# EAGLE design 2164_svf_breakout_planes (EAGLE 9.6.2)
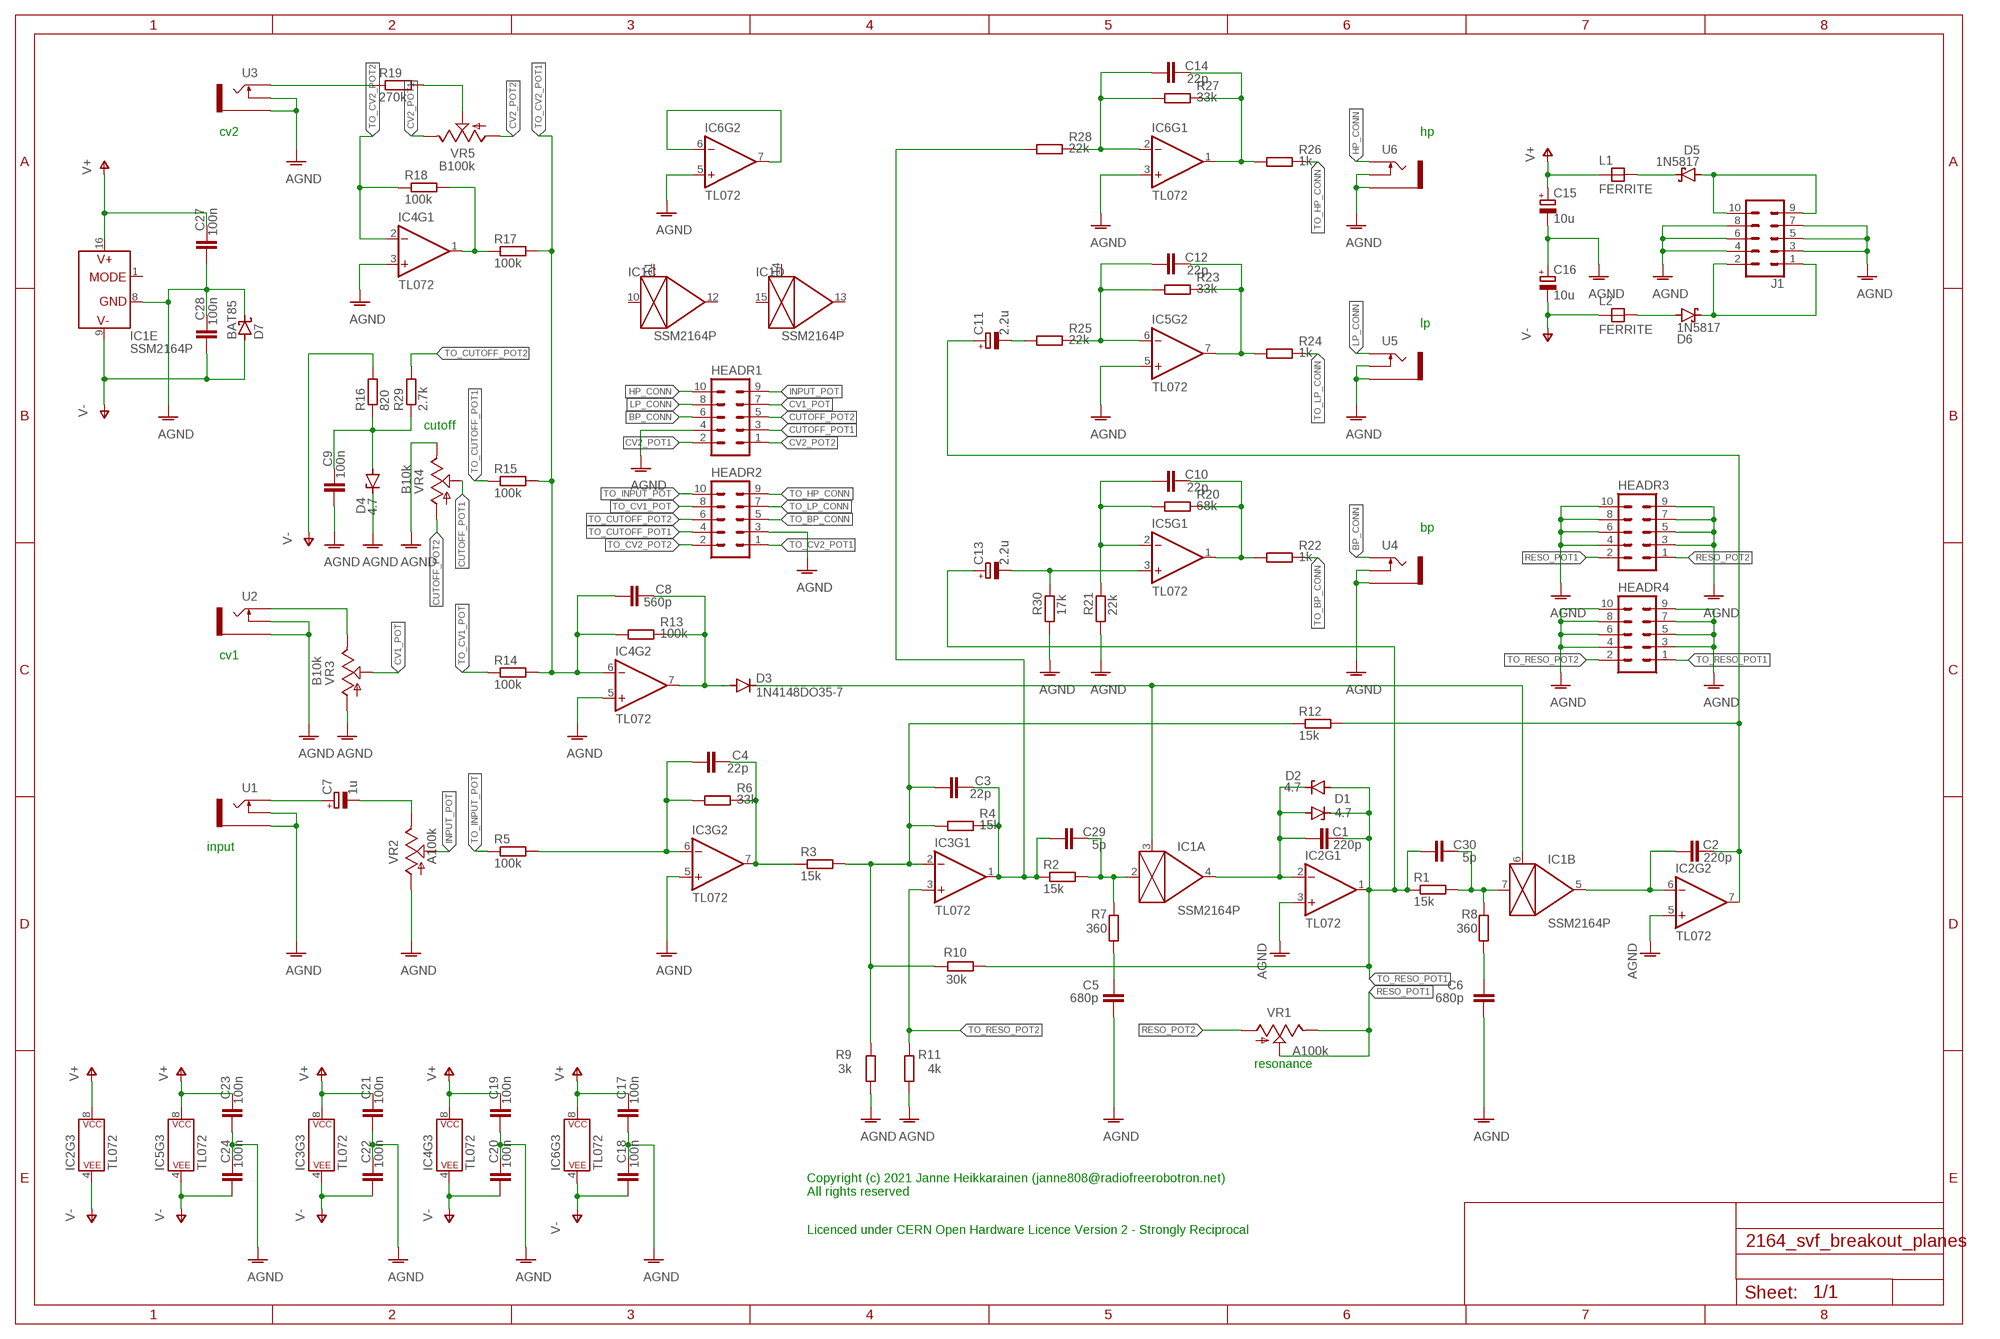
[diagram p0: schematic, sheet 1]

## Parts
C1  220p  C-EU050-025X075  [C050-025X075]
C2  220p  C-EU050-025X075  [C050-025X075]
C3  22p  C-EU050-025X075  [C050-025X075]
C4  22p  C-EU050-025X075  [C050-025X075]
C5  680p  C-EU050-025X075  [C050-025X075]
C6  680p  C-EU050-025X075  [C050-025X075]
C7  1u  CPOL-EUE2,5-6E  [E2,5-6E]
C8  560p  C-EU050-025X075  [C050-025X075]
C9  100n  C-EU050-025X075  [C050-025X075]
C10  22p  C-EU050-025X075  [C050-025X075]
C11  2.2u  CPOL-EUE2,5-6E  [E2,5-6E]
C12  22p  C-EU050-025X075  [C050-025X075]
C13  2.2u  CPOL-EUE2,5-6E  [E2,5-6E]
C14  22p  C-EU050-025X075  [C050-025X075]
C15  10u  CPOL-EUE2,5-6E  [E2,5-6E]
C16  10u  CPOL-EUE2,5-6E  [E2,5-6E]
C17  100n  C-EU050-025X075  [C050-025X075]
C18  100n  C-EU050-025X075  [C050-025X075]
C19  100n  C-EU050-025X075  [C050-025X075]
C20  100n  C-EU050-025X075  [C050-025X075]
C21  100n  C-EU050-025X075  [C050-025X075]
C22  100n  C-EU050-025X075  [C050-025X075]
C23  100n  C-EU050-025X075  [C050-025X075]
C24  100n  C-EU050-025X075  [C050-025X075]
C27  100n  C-EU050-025X075  [C050-025X075]
C28  100n  C-EU050-025X075  [C050-025X075]
C29  5p  C-EU050-025X075  [C050-025X075]
C30  5p  C-EU050-025X075  [C050-025X075]
D1  4.7  ZENER-DIODEDO34-7  [DO34Z7]
D2  4.7  ZENER-DIODEDO34-7  [DO34Z7]
D3  1N4148DO35-7  [DO35-7]
D4  4.7  ZENER-DIODEDO34-7  [DO34Z7]
D5  1N5817  SCHOTTKY-DIODEDO35-7  [DO35-7]
D6  1N5817  SCHOTTKY-DIODEDO35-7  [DO35-7]
D7  BAT85  SCHOTTKY-DIODEDO35-7  [DO35-7]
HEADR1  10PIN_BACKSIDE  [10PIN_BACKSIDE]
HEADR2  10PIN_BACKSIDE  [10PIN_BACKSIDE]
HEADR3  10PIN_BACKSIDE  [10PIN_BACKSIDE]
HEADR4  10PIN_BACKSIDE  [10PIN_BACKSIDE]
IC1  SSM2164P  [DIL16]
IC2  TL072  OPAMP-DUALDIP  [DIP08]
IC3  TL072  OPAMP-DUALDIP  [DIP08]
IC4  TL072  OPAMP-DUALDIP  [DIP08]
IC5  TL072  OPAMP-DUALDIP  [DIP08]
IC6  TL072  OPAMP-DUALDIP  [DIP08]
J1  CONN_05X2SHD  [2X5-SHROUDED]
L1  FERRITE  FB-085  [FB-085]
L2  FERRITE  FB-085  [FB-085]
R1  15k  R-EU_0207/2V  [0207/2V]
R2  15k  R-EU_0207/2V  [0207/2V]
R3  15k  R-EU_0207/2V  [0207/2V]
R4  15k  R-EU_0207/2V  [0207/2V]
R5  100k  R-EU_0207/2V  [0207/2V]
R6  33k  R-EU_0207/2V  [0207/2V]
R7  360  R-EU_0207/2V  [0207/2V]
R8  360  R-EU_0207/2V  [0207/2V]
R9  3k  R-EU_0207/2V  [0207/2V]
R10  30k  R-EU_0207/2V  [0207/2V]
R11  4k  R-EU_0207/2V  [0207/2V]
R12  15k  R-EU_0207/2V  [0207/2V]
R13  100k  R-EU_0207/2V  [0207/2V]
R14  100k  R-EU_0207/2V  [0207/2V]
R15  100k  R-EU_0207/2V  [0207/2V]
R16  820  R-EU_0207/2V  [0207/2V]
R17  100k  R-EU_0207/2V  [0207/2V]
R18  100k  R-EU_0207/2V  [0207/2V]
R19  270k  R-EU_0207/2V  [0207/2V]
R20  68k  R-EU_0207/2V  [0207/2V]
R21  22k  R-EU_0207/2V  [0207/2V]
R22  1k  R-EU_0207/2V  [0207/2V]
R23  33k  R-EU_0207/2V  [0207/2V]
R24  1k  R-EU_0207/2V  [0207/2V]
R25  22k  R-EU_0207/2V  [0207/2V]
R26  1k  R-EU_0207/2V  [0207/2V]
R27  33k  R-EU_0207/2V  [0207/2V]
R28  22k  R-EU_0207/2V  [0207/2V]
R29  2.7k  R-EU_0207/2V  [0207/2V]
R30  17k  R-EU_0207/2V  [0207/2V]
U1  THONKICONNNEW  [WQP-PJ301M-12_JACK]
U2  THONKICONNNEW  [WQP-PJ301M-12_JACK]
U3  THONKICONNNEW  [WQP-PJ301M-12_JACK]
U4  THONKICONNNEW  [WQP-PJ301M-12_JACK]
U5  THONKICONNNEW  [WQP-PJ301M-12_JACK]
U6  THONKICONNNEW  [WQP-PJ301M-12_JACK]
VR1  A100k  9MM_SNAP-IN_POT_  [9MM_SNAP-IN_POT]
VR2  A100k  9MM_SNAP-IN_POT_  [9MM_SNAP-IN_POT]
VR3  B10k  9MM_SNAP-IN_POT_  [9MM_SNAP-IN_POT]
VR4  B10k  9MM_SNAP-IN_POT_  [9MM_SNAP-IN_POT]
VR5  B100k  9MM_SNAP-IN_POT_  [9MM_SNAP-IN_POT]

## Nets
AGND: C5.1 C6.1 C9.1 C15.- C16.+ C17.1 C18.2 C19.1 C20.2 C21.1 C22.2 C23.1 C24.2 C27.1 C28.2 D4.C D7.C HEADR1.4 HEADR2.3 HEADR3.3 HEADR3.4 HEADR3.5 HEADR3.6 HEADR3.7 HEADR3.8 HEADR3.9 HEADR3.10 HEADR4.3 HEADR4.4 HEADR4.5 HEADR4.6 HEADR4.7 HEADR4.8 HEADR4.9 HEADR4.10 IC1.8(E:GND) IC2.3(+IN) IC2.5(+IN) IC3.5(+IN) IC4.3(+IN) IC4.5(+IN) IC5.5(+IN) IC6.3(+IN) IC6.5(+IN) J1.3 J1.4 J1.5 J1.6 J1.7 J1.8 R9.1 R11.1 R21.1 R30.1 U1.P$2_SWITCH(SWITCH) U1.P$3_SLEEVE(SLEEVE) U2.P$2_SWITCH(SWITCH) U2.P$3_SLEEVE(SLEEVE) U3.P$2_SWITCH(SWITCH) U3.P$3_SLEEVE(SLEEVE) U4.P$2_SWITCH(SWITCH) U4.P$3_SLEEVE(SLEEVE) U5.P$2_SWITCH(SWITCH) U5.P$3_SLEEVE(SLEEVE) U6.P$2_SWITCH(SWITCH) U6.P$3_SLEEVE(SLEEVE) VR2.1(A) VR3.1(A) VR4.3(E)
BP_CONN: HEADR1.6 U4.P$1_TIP(TIP)
CUTOFF_POT1: HEADR1.3 VR4.2(S)
CUTOFF_POT2: HEADR1.5 VR4.1(A)
CV1_POT: HEADR1.7 VR3.2(S)
CV2_POT1: HEADR1.2 VR5.3(E)
CV2_POT2: HEADR1.1 VR5.1(A)
HP_CONN: HEADR1.10 U6.P$1_TIP(TIP)
INPUT_POT: HEADR1.9 VR2.2(S)
LP_CONN: HEADR1.8 U5.P$1_TIP(TIP)
N$1: C1.1 D1.A D2.C IC1.4(A:OUT) IC2.2(-IN)
N$2: C2.1 IC1.5(B:OUT) IC2.6(-IN)
N$3: C13.- IC5.3(+IN) R30.2
N$4: C30.2 IC1.7(B:IN) R1.2 R8.2
N$5: C3.2 C29.1 IC3.1(OUT) R2.1 R4.2 R28.1
N$6: C29.2 IC1.2(A:IN) R2.2 R7.2
N$7: C9.2 D4.A R16.1 R29.1
N$8: C4.2 IC3.7(OUT) R3.1 R6.2
N$9: C3.1 IC3.2(-IN) R3.2 R4.1 R9.2 R10.2 R12.1
N$10: C4.1 IC3.6(-IN) R5.2 R6.1
N$12: C2.2 C11.+ IC2.7(OUT) R12.2
N$13: C7.- VR2.3(E)
N$14: C7.+ U1.P$1_TIP(TIP)
N$15: C5.2 R7.1
N$16: C6.2 R8.1
N$17: C8.2 D3.A IC4.7(OUT) R13.2
N$18: D3.C IC1.3(A:CTRL) IC1.6(B:CTRL)
N$21: U2.P$1_TIP(TIP) VR3.3(E)
N$23: IC4.1(OUT) R17.1 R18.2
N$26: C10.1 IC5.2(-IN) R20.1 R21.2
N$27: R19.1 U3.P$1_TIP(TIP)
N$28: R19.2 VR5.2(S)
N$29: C10.2 IC5.1(OUT) R20.2 R22.1
N$31: C12.1 IC5.6(-IN) R23.1 R25.2
N$33: C12.2 IC5.7(OUT) R23.2 R24.1
N$34: C11.- R25.1
N$37: IC6.6(-IN) IC6.7(OUT)
N$38: D5.C L1.2
N$39: C14.2 IC6.1(OUT) R26.1 R27.2
N$40: C14.1 IC6.2(-IN) R27.1 R28.2
N$41: D6.A L2.2
N$42: D6.C J1.1 J1.2
N$43: D5.A J1.9 J1.10
RESO_POT1: HEADR3.2 VR1.2(S) VR1.3(E)
RESO_POT2: HEADR3.1 VR1.1(A)
TO_BP_CONN: HEADR2.5 R22.2
TO_CUTOFF_POT1: HEADR2.4 R15.1
TO_CUTOFF_POT2: HEADR2.6 R29.2
TO_CV1_POT: HEADR2.8 R14.1
TO_CV2_POT1: C8.1 HEADR2.1 IC4.6(-IN) R13.1 R14.2 R15.2 R17.2
TO_CV2_POT2: HEADR2.2 IC4.2(-IN) R18.1
TO_HP_CONN: HEADR2.9 R26.2
TO_INPUT_POT: HEADR2.10 R5.1
TO_LP_CONN: HEADR2.7 R24.2
TO_RESO_POT1: C1.2 C13.+ C30.1 D1.C D2.A HEADR4.1 IC2.1(OUT) R1.1 R10.1
TO_RESO_POT2: HEADR4.2 IC3.3(+IN) R11.2
V+: C15.+ C17.2 C19.2 C21.2 C23.2 C27.2 IC1.16(E:V+) IC2.8(P$V+) IC3.8(P$V+) IC4.8(P$V+) IC5.8(P$V+) IC6.8(P$V+) L1.1
V-: C16.- C18.1 C20.1 C22.1 C24.1 C28.1 D7.A IC1.9(E:V-) IC2.4(P$V-) IC3.4(P$V-) IC4.4(P$V-) IC5.4(P$V-) IC6.4(P$V-) L2.1 R16.2
Unconnected: IC1.1(E:MODE) IC1.10(C:IN) IC1.11(C:CTRL) IC1.12(C:OUT) IC1.13(D:OUT) IC1.14(D:CTRL) IC1.15(D:IN)

## Notes on the sheet
- cv2 | hp
- lp
- cutoff
- bp
- cv1
- input
- resonance
- Copyright (c) 2021 Janne Heikkarainen (janne808@radiofreerobotron.net)
  All rights reserved
- Licenced under CERN Open Hardware Licence Version 2 - Strongly Reciprocal

## Library data of the parts
C1-C6 C8-C10 C12 C14 C17-C24 C27-C30 = rcl:C-EU: CAPACITOR, European symbol; SPICEPREFIX: C
C7 C11 C13 C15 C16 = rcl:CPOL-EU: POLARIZED CAPACITOR, European symbol; SPICEPREFIX: C
D1 D2 D4 = diode:ZENER-DIODE: Z-Diode
D3 = diode:1N4148: DIODE high speed (Philips)
D5-D7 = diode:SCHOTTKY-DIODE: Schottky Diode
HEADR1-HEADR4 = MusicThingModular:10PIN_BACKSIDE: PIN HEADER; OC_FARNELL: unknown; OC_NEWARK: unknown
IC1 = ssm2164:SSM2164
IC2-IC6 = SparkFun-IC-Amplifiers:OPAMP-DUAL: Generic op-amp footprint This component is for the standard 358 pinning of a dual op-amp From the LM358 datasheet: Pin 1: Output A Pin 2: Inverting Input A Pin 3: Non-Inverting Input A Pin 4: Gnd Pin 5: Non-Inverting Input B Pin 6: Inverting Input B Pin 7: Output B Pin 8: V+; PROD_ID: NA-XXXXX; VALUE: OP-AMP
J1 = SparkFun-Connectors:CONN_05X2: Multi connection point. Often used as Generic Header-pin footprint for 0.1 inch spaced/style header connections For AVR SPI programming port, see special device with nice symbol: "AVR_SPI_PROG_5x2.dev" You can populate with any combo of single row headers, but if you'd like an exact match, check these: 2x5 AVR ICSP Male Header <https://www.sparkfun.com/products/778> (PRT-00778) 2x5 Pin Shrouded Header <https://www.sparkfun.com/products/8506> (PRT-08506) On any of the 0.1 inch spaced packages, you can populate with these: Break Away Headers - Straight <https://www.sparkfun.com/products/116> (PRT-00116) Break Away Male Headers - Right Angle <https://www.sparkfun.com/products/553> (PRT-00553) Female Headers <https://www.sparkfun.com/products/115> (PRT-00115) Break Away Headers - Machine Pin <https://www.sparkfun.com/products/117> (PRT-00117) Break Away Female Headers - Swiss Machine Pin <https://www.sparkfun.com/products/743> (PRT-00743) Special note: the shrouded connector mates well with our 5x2 ribbon cables: 2x5 Pin IDC Ribbon Cable <https://www.sparkfun.com/products/8535> (PRT-08535); PROD_ID: CONN-08671; SF_ID: PRT-08506
L1 L2 = inductors-jwmiller:FB: FERRITE BEAD
R1-R30 = rcl:R-EU_: RESISTOR, European symbol; SPICEPREFIX: R
U1-U6 = MusicThingModular:THONKICONN: 3.5mm socket for Eurorack modular synths
VR1-VR5 = MusicThingModular:9MM_SNAP-IN_POT: 9mm vertical snap-in pot, Alpha / Panasonic style

## Board
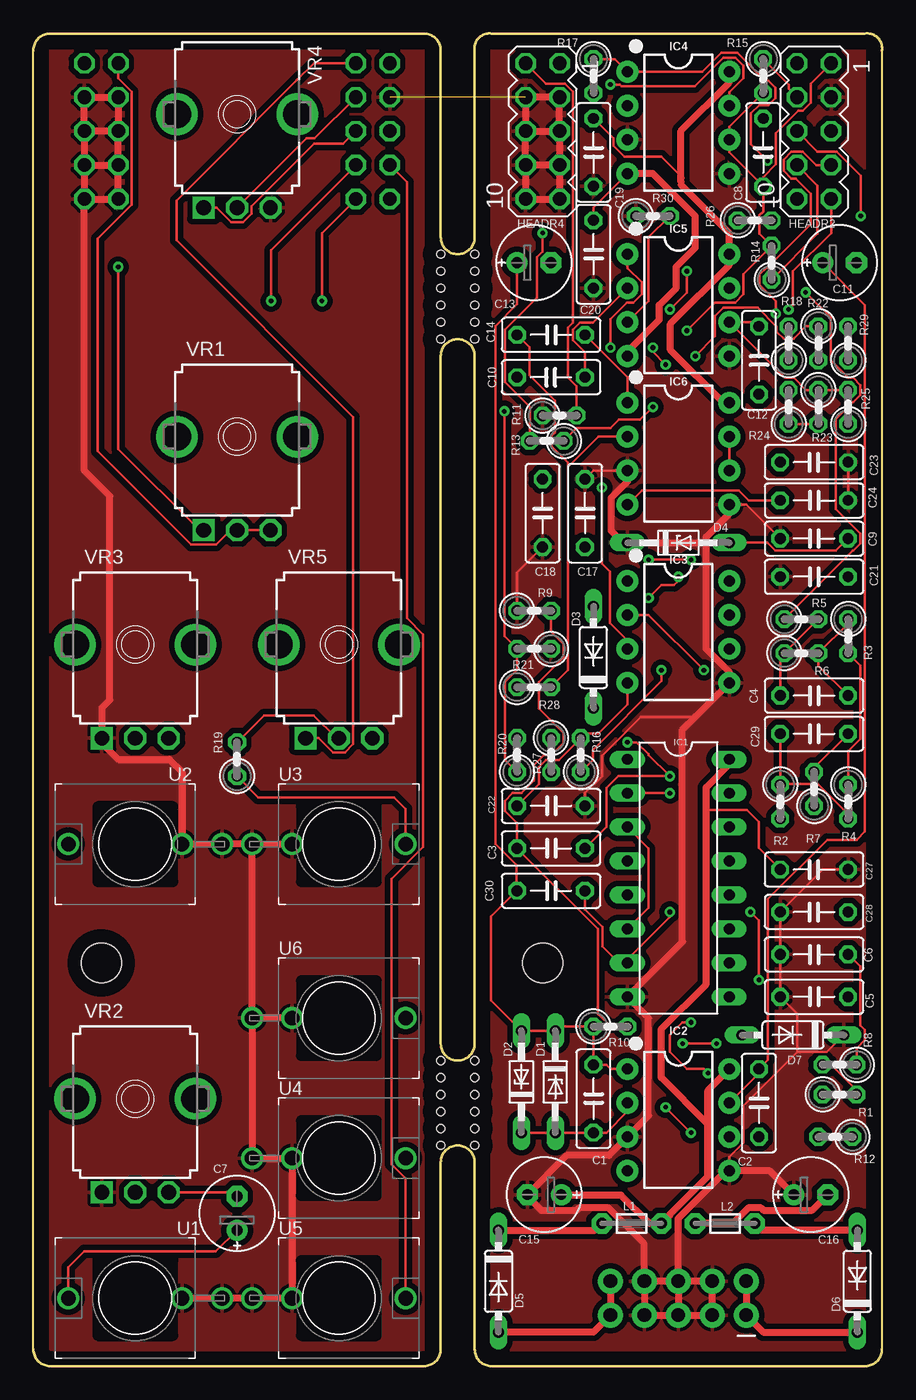
[diagram p1: board, top side]
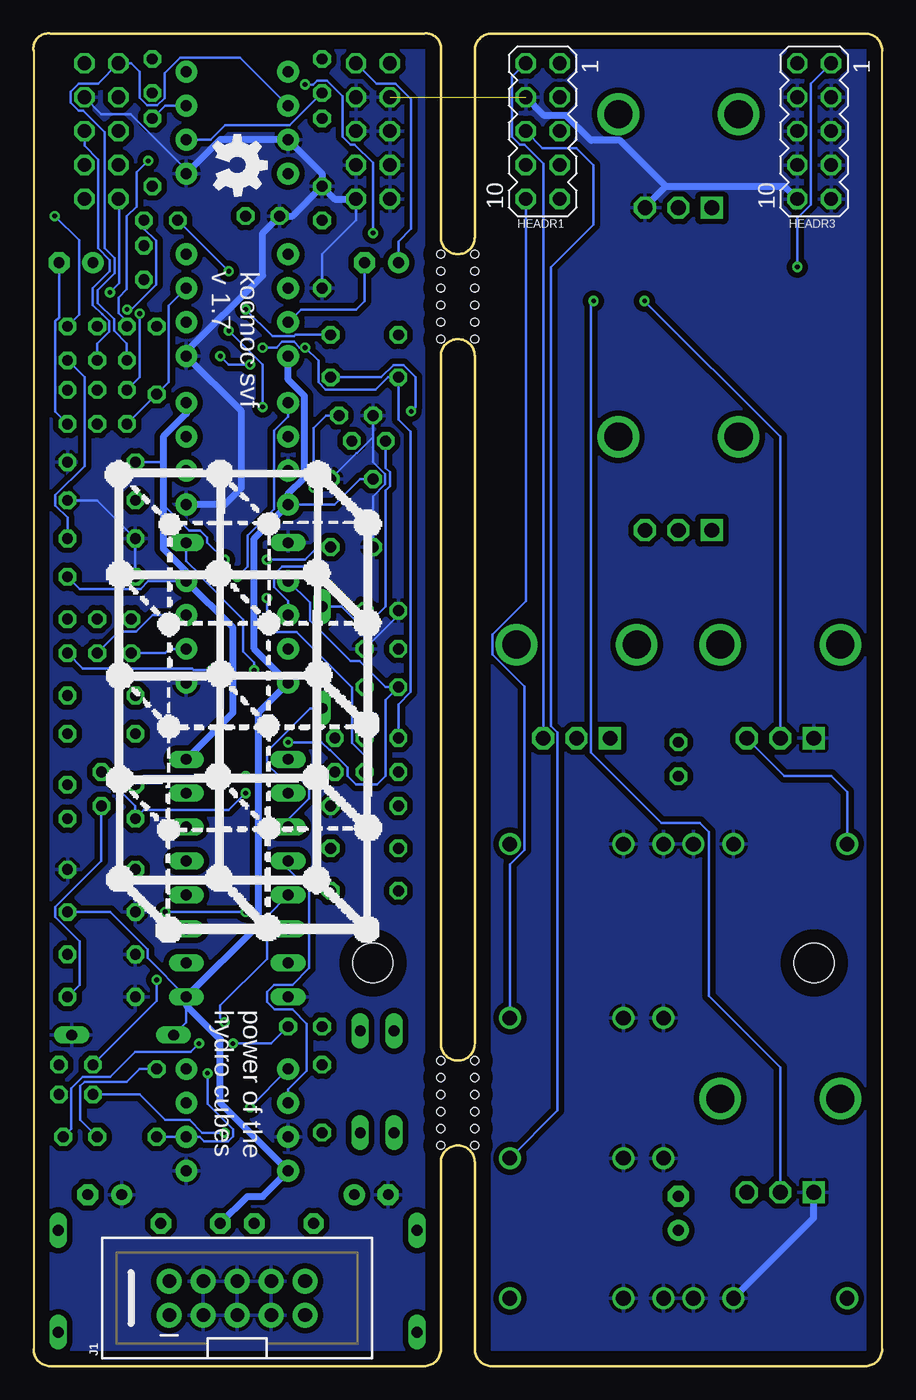
[diagram p2: board, bottom side, seen from below]

Size 63.51 x 99.71 mm. Coordinates in mm from the lower left corner, seen from the top.
Outline: 0,1.27 0,98.42 arc-90 1.27,99.69 29.21,99.69 arc-90 30.48,98.42 30.48,84.45 arc180 33.02,84.45 33.02,98.42 arc-106 34.29,99.69 62.23,99.69 arc-106 63.5,98.42 63.5,1.27 arc-90 62.23,0 34.29,0 arc-90 33.02,1.27 33.02,15.24 arc180 30.48,15.24 30.48,1.27 arc-90 29.21,0 1.27,0 arc-90 0,1.27
Outline: 30.48,75.56 arc-180 33.02,75.56 33.02,24.13 arc-180 30.48,24.13 30.48,75.56
Copper layers (1*16): Top 0.035mm / dielectric 1.5mm / Bottom 0.035mm
Design rules "default": minimum track width 6mil, minimum drill 0.35mm, track to track 6mil, track to pad 6mil, pad to pad 6mil, via to via 6mil, smd to smd 6mil, copper to edge 40mil, drill to drill 6mil, minimum pad ring 10mil, minimum via ring 8mil, stop-mask expansion 4mil, vias tented up to drill 0mil, thermal gap 10mil
Holes 3 mm at 5.08,30.16 38.1,30.16
Holes 0.6 mm at 30.48,83.19 33.02,83.19 30.48,81.92 33.02,81.92 30.48,80.64 33.02,80.64 30.48,79.38 33.02,79.38 30.48,78.11 33.02,78.11 30.48,76.83 33.02,76.83 33.02,22.86 30.48,22.86 30.48,21.59 33.02,21.59 33.02,20.32 30.48,20.32 30.48,19.05 33.02,19.05 33.02,17.78 30.48,17.78 30.48,16.51 33.02,16.51

### Footprints (pad centres in the part's own frame; a part is rotated, then mirrored left to right if it is on the bottom)
C050-025X075 = drill 0.813 octagon: 1 -2.54,0; 2 2.54,0
E2,5-6E = drill 0.813 pad 1.575: + -1.27,0 | drill 0.813 pad 1.575 octagon: - 1.27,0
DO34Z7 = drill 0.813 long: A 3.81,0; C -3.81,0
DO35-7 = drill 0.813 long: A 3.81,0; C -3.81,0
10PIN_BACKSIDE = drill 1.016 octagon: 1 -5.08,-1.27; 2 -5.08,1.27; 3 -2.54,-1.27; 4 -2.54,1.27; 5 0,-1.27; 6 0,1.27; 7 2.54,-1.27; 8 2.54,1.27; 9 5.08,-1.27; 10 5.08,1.27
DIL16 = drill 0.813 long: 1 -8.89,-3.81; 2 -6.35,-3.81; 3 -3.81,-3.81; 4 -1.27,-3.81; 5 1.27,-3.81; 6 3.81,-3.81; 7 6.35,-3.81; 8 8.89,-3.81; 9 8.89,3.81; 10 6.35,3.81; 11 3.81,3.81; 12 1.27,3.81; 13 -1.27,3.81; 14 -3.81,3.81; 15 -6.35,3.81; 16 -8.89,3.81
DIP08 = drill 0.813 pad 1.626: 1 -3.81,-3.81; 2 -1.27,-3.81; 3 1.27,-3.81; 4 3.81,-3.81; 5 3.81,3.81; 6 1.27,3.81; 7 -1.27,3.81; 8 -3.81,3.81
2X5-SHROUDED = drill 1.016 pad 1.88: 1 -1.27,5.08; 2 1.27,5.08; 3 -1.27,2.54; 4 1.27,2.54; 5 -1.27,0; 6 1.27,0; 7 -1.27,-2.54; 8 1.27,-2.54; 9 -1.27,-5.08; 10 1.27,-5.08
FB-085 = drill 0.813 pad 1.524 octagon: 1 -2.223,0; 2 2.223,0
0207/2V = drill 0.813 octagon: 1 -1.27,0; 2 1.27,0
WQP-PJ301M-12_JACK = drill 1.1: P$1_TIP 0,5; P$2_SWITCH 0,-3.5; P$3_SLEEVE 0,-6.5
9MM_SNAP-IN_POT = drill 1.1 square: 1 -2.5,-7 | drill 1.1 octagon: 2 0,-7; 3 2.5,-7 | drill 2.1 pad 2.794: CHASSIS1 -4.5,0; CHASSIS2 4.5,0

### Placement (x,y rotation side)
C1  41.91,20 90 top
C2  54.29,19.68 90 top
C3  38.73,38.73 0 top
C4  58.42,50.16 0 top
C5  58.42,27.62 0 top
C6  58.42,30.8 0 top
C7  15.24,11.43 90 top
C8  54.61,90.81 90 top
C9  58.42,61.91 0 top
C10  38.73,73.98 180 top
C11  60.33,82.55 0 top
C12  54.29,75.25 270 top
C13  37.47,82.55 0 top
C14  38.73,77.15 0 top
C15  38.23,12.83 180 top
C16  58.17,12.83 0 top
C17  41.27,63.82 270 top
C18  38.1,63.82 270 top
C19  41.91,90.81 90 top
C20  41.91,83.19 270 top
C21  58.42,59.05 0 top
C22  38.73,41.91 0 top
C23  58.42,67.63 180 top
C24  58.42,64.77 0 top
C27  58.42,37.15 180 top
C28  58.42,33.97 180 top
C29  58.42,47.31 0 top
C30  38.73,35.56 0 top
D1  39.05,21.27 270 top
D2  36.51,21.27 90 top
D3  41.91,53.02 90 top
D4  48.26,61.59 0 top
D5  34.8,6.35 270 top
D6  61.66,6.35 90 top
D7  56.83,24.77 180 top
HEADR1  25.4,92.39 270 top
HEADR2  58.42,92.39 270 bottom
HEADR3  5.08,92.39 270 top
HEADR4  38.1,92.39 270 bottom
IC1  48.26,36.51 270 top
IC2  48.26,18.41 270 top
IC3  48.26,54.93 270 top
IC4  48.26,93.03 270 top
IC5  48.26,79.38 270 top
IC6  48.26,68.26 270 top
J1  48.26,5.08 90 bottom
L1  44.77,10.67 180 top
L2  51.75,10.67 0 top
R1  60.33,20.32 0 top
R2  55.88,42.23 270 top
R3  60.96,54.61 270 top
R4  60.96,42.23 270 top
R5  57.47,55.88 0 top
R6  57.47,53.34 0 top
R7  58.42,43.18 90 top
R8  60.33,22.54 180 top
R9  37.47,56.52 0 top
R10  43.18,25.4 0 top
R11  39.37,71.12 0 top
R12  60.01,17.14 180 top
R13  38.42,69.22 180 top
R14  55.24,82.55 90 top
R15  54.61,96.52 270 top
R16  40.96,45.72 90 top
R17  41.91,96.52 270 top
R18  56.52,76.52 90 top
R19  15.24,45.4 90 top
R20  36.2,45.72 90 top
R21  37.47,53.66 180 top
R22  58.74,76.52 270 top
R23  58.74,71.75 270 top
R24  56.52,71.75 90 top
R25  60.96,71.75 90 top
R26  53.98,85.72 0 top
R27  38.73,45.72 270 top
R28  37.47,50.8 0 top
R29  60.96,76.52 90 top
R30  46.35,86.04 0 top
U1  7.62,5.08 90 top
U2  7.62,39.05 90 top
U3  22.86,39.05 270 top
U4  22.86,15.56 270 top
U5  22.86,5.08 270 top
U6  22.86,26.04 270 top
U$1  [OSHW_5MM]  48.26,89.85 270 bottom
VR1  15.24,69.53 0 top
VR2  7.62,20 0 top
VR3  7.62,53.98 0 top
VR4  15.24,93.66 0 top
VR5  22.86,53.98 0 top

### Tracks (layer width: path | path; a pad name or v marks a point on that pad's centre or on a via)
AGND  (1 unrouted)
  Top 0.2: D4.C 44.13,61.59 | 52.07,14.92 IC2.5 52.07,15.64 53.13,16.7 53.13,19.48 57.15,23.5 | C27.1 59.05,37.15 C28.2 C6.1 C5.1 57.15,26.35 57.15,23.5 | C9.1 53.34,64.45 IC6.5 | C22.2 41.27,42.86 42.52,44.11 42.52,45.64 45.46,48.58 49.53,48.58 | C17.1 41.91,66.99 IC6.3 | R9.1 36.2,59.37 C18.2 | C24.2 C23.1 | 57.15,23.5 59.37,23.5 D7.C
  Top 0.508: U2.P$2_SWITCH 11.12,44.44 10.16,45.4 6.35,45.4 5.12,46.63 VR3.1 5.12,49.25 5.71,49.85 5.71,65.09 3.81,66.99 HEADR3.9 | U2.P$2_SWITCH U2.P$3_SLEEVE U3.P$3_SLEEVE | U3.P$3_SLEEVE U3.P$2_SWITCH | U2.P$2_SWITCH 11.12,44.46 | U6.P$2_SWITCH U6.P$3_SLEEVE | U6.P$3_SLEEVE U3.P$3_SLEEVE | U6.P$3_SLEEVE U4.P$3_SLEEVE U4.P$2_SWITCH U5.P$2_SWITCH U5.P$3_SLEEVE U1.P$3_SLEEVE U1.P$2_SWITCH | C16.+ 55.12,14.61 IC2.5 51.81,14.61 48.26,11.05 J1.6 | IC6.3 44.45,66.18 43.23,64.96 43.23,62.5 44.13,61.59 | IC6.5 52.07,63.76 50.34,62.04 50.34,61.59 | 50.34,61.59 50.34,53.66 52.07,51.93 IC3.5 49.53,48.58 48.58,47.62 48.58,31.75 IC1.8 46.04,26.04 46.04,18.73 IC2.3 43.07,15.76 39.89,15.76 C15.- 36.96,12.73 38.05,11.63 40.63,11.63 40.83,11.84 43.03,11.84 45.72,9.14 J1.8 | D4.C 50.34,61.59 | J1.6 J1.4 J1.3 J1.5 | J1.6 J1.8 | J1.8 J1.7 J1.5 | J1.6 J1.5 | HEADR4.7 HEADR4.9 HEADR4.10 HEADR4.8 | HEADR4.7 HEADR4.8 | HEADR4.8 HEADR4.6 | HEADR4.6 HEADR4.5 | HEADR4.5 HEADR4.7 | HEADR4.5 HEADR4.3 HEADR4.4 HEADR4.6 | HEADR3.6 HEADR3.4 HEADR3.3 HEADR3.5 | HEADR3.6 HEADR3.5 | HEADR3.5 HEADR3.7 | HEADR3.7 HEADR3.8 | HEADR3.8 HEADR3.6 | HEADR3.7 HEADR3.9 | HEADR3.9 HEADR3.10 HEADR3.8
  Bottom 0.2: C20.2 41.91,83.19 39.37,85.72 HEADR4.9 | IC4.5 52.07,89.51 56.22,93.66 58.42,93.66 HEADR2.3 | C21.1 C9.1 58.74,64.77 C24.2 | R21.1 36.2,56.2 R9.1 | C17.1 39.33,68.3 39.31,68.3 38.1,69.51 | 38.1,69.51 R11.1 | C18.2 38.1,65.07 37.19,65.98 37.19,66.74 38.1,67.65 38.1,69.51
  Bottom 0.508: U1.P$2_SWITCH 5.12,11.08 VR2.1 | 16.19,88.27 17.74,86.72 VR4.3 | 16.19,88.27 19.63,91.7 21.78,91.7 23.65,93.56 25.3,93.56 HEADR1.4 | 44.77,91.76 IC4.3 41.91,89.22 C19.1 | 44.77,91.76 49.53,91.76 IC4.5 | IC6.5 49.21,64.45 47.94,65.72 47.94,71.44 IC5.5 52.07,75.88 46.35,81.6 46.35,84.77 R30.1 44.13,86.04 C19.1 | C19.1 40.96,87.31 HEADR4.9 | 44.77,91.26 44.77,91.76 | 16.19,88.27 7.3,88.27 HEADR3.10
  pour Bottom (isolate 0.406): 34.29,0.64 62.23,0.64 62.23,99.06 34.29,99.06
  pour Top (isolate 0.406): 34.29,0.64 62.23,0.64 62.23,99.06 34.29,99.06
  pour Top (isolate 0.406): 1.27,0.64 29.21,0.64 29.21,99.06 1.27,99.06
  pour Bottom (isolate 0.406): 1.27,0.64 29.21,0.64 29.21,99.06 1.27,99.06
BP_CONN
  Bottom 0.2: U4.P$1_TIP 24.28,19.14 24.28,47.42 24.77,47.9 24.77,82.23 21.59,85.41 21.59,89.85 22.86,91.12 25.4,91.12 HEADR1.6
CUTOFF_POT1
  Top 0.2: VR4.2 20.43,91.85 21.05,91.85 HEADR1.3
CUTOFF_POT2
  Top 0.2: VR4.1 13.72,86.66 14.79,85.58 15.69,85.58 16.32,86.22 16.32,86.76 20.99,91.44 23.18,91.44 HEADR1.5
CV1_POT  (via drill 0.35)
  Top 0.2: HEADR1.7 17.78,83.5 v17.78,79.69
  Bottom 0.2: VR3.2 7.62,69.53 v17.78,79.69
CV2_POT1
  Bottom 0.2: VR5.3 25.36,89.98 26.76,91.38 27.09,91.38 27.68,91.97 27.68,92.71 27.68,92.81 27.68,96.46 HEADR1.2
CV2_POT2
  Top 0.2: VR5.1 21.34,46.98 22.41,45.9 23.31,45.9 23.94,46.53 23.94,71 10.71,84.22 10.71,87.19 19.7,96.19 19.78,96.26 20.99,97.47 HEADR1.1
HP_CONN
  Bottom 0.2: U6.P$1_TIP 27.86,37.53 26.78,38.61 26.78,50.84 29.17,53.23 29.17,54.73 26.67,57.23 HEADR1.10
INPUT_POT  (via drill 0.35)
  Top 0.2: v21.59,79.69 21.59,84.77 HEADR1.9
  Bottom 0.2: VR2.2 7.62,22.34 12.96,27.68 12.96,39.95 13.65,40.64 16.51,40.64 21.78,45.91 21.78,79.5 v21.59,79.69
LP_CONN
  Top 0.2: U5.P$1_TIP 27.86,14.03 26.78,15.11 26.78,36.45 29.17,38.84 29.17,54.73 27.94,55.95 27.94,88.58 HEADR1.8
N$1
  Top 0.2: IC2.2 44.45,19.05 42.86,17.46 C1.1 D1.A D2.C
  Bottom 0.2: IC1.4 44.45,37.19 42.88,35.62 42.88,29.78 44.13,28.54 45.49,28.54 46.02,28 46.02,27.24 45.45,26.67 44.13,26.67 43.07,25.61 43.07,22.1 44.45,20.72 IC2.2
N$2  (via drill 0.35)
  Top 0.2: v50.48,21.91 50.16,22.23 48.9,22.23 47.62,23.5 47.62,24.77 48.58,25.72 v49.21,25.72
  Bottom 0.2: v50.48,21.91 50.48,19.62 48.58,17.72 48.58,17.2 48.95,16.83 50.75,16.83 51.06,17.14 IC2.6 C2.1 | IC1.5 46.04,33.66 46.04,30.48 49.53,26.99 49.53,26.04 v49.21,25.72
N$3
  Top 0.2: IC5.3 46.04,79.69 46.04,84.45 R30.2
  Bottom 0.2: C13.- 38.73,79.69 39.37,79.06 43.5,79.06 IC5.3
N$4  (via drill 0.35)
  Top 0.2: C30.2 41.27,34.15 42.58,32.85 42.58,31.4 43.81,30.16 IC1.7 44.45,30.43 47.62,33.61 v47.62,33.97 | v54.29,28.89 54.29,33.34 v53.66,33.97 | R1.2 61.59,20.64 59.69,22.54 R8.2
  Bottom 0.2: v53.66,33.97 v47.62,33.97 | R8.2 54.29,27.3 v54.29,28.89
N$5  (via drill 0.35)
  Top 0.2: R4.2 60.96,41.27 58.7,43.54 55.92,43.54 R2.1 C29.1 | v44.45,46.67 45.13,46.67 46.02,45.78 46.02,45.73 v47.62,44.13 43.77,44.13 42.88,43.24 42.88,40.34 C3.2
  Bottom 0.2: v47.62,44.13 55.24,44.13 R2.1 | IC3.1 42.82,57.11 42.82,55.79 39.77,52.74 39.11,52.74 37.17,50.8 R28.1 37.15,49.85 37.15,44.13 37.78,43.5 39.37,43.5 40.01,44.13 40.01,44.79 41.29,46.08 41.34,46.08 41.93,46.67 v44.45,46.67
N$6  (via drill 0.35)
  Top 0.2: v47.62,42.86 IC1.2 | R7.2 58.42,44.77 C29.2
  Bottom 0.2: R7.2 55.88,41.91 R2.2 55.24,41.59 48.9,41.59 v47.62,42.86
N$7  (via drill 0.35)
  Top 0.2: D4.A 54.91,61.59 55.5,61 60.05,61 C9.2 | R16.1 41.85,45.35 41.85,46.1 46.99,51.24 v46.99,52.07
  Bottom 0.2: R29.1 59.69,73.98 59.69,67.33 61.87,65.15 61.87,64.39 60.96,63.48 C9.2 | D4.A 52.07,60.24 51.01,59.18 51.01,59.05 47.81,55.86 47.81,53.45 46.99,52.62 v46.99,52.07
N$8
  Top 0.2: C4.2 58.74,52.39 R6.2 60.96,55.56 R3.1
  Bottom 0.2: IC3.7 54.59,56.2 55.82,54.97 57.11,54.97 R6.2
N$9  (via drill 0.35)
  Top 0.2: R4.1 60.96,46.02 61.87,46.93 61.87,52.43 R3.2 | IC3.2 46.04,56.2 v50.16,52.07 | R9.2 38.73,54.95 39.65,54.04 39.65,53 37.82,51.18 37.82,49.19 39.65,47.37 39.65,46.61 38.75,45.72 38.21,45.72 37.47,44.97 37.47,43.82 36.51,42.86 35.86,42.86 35.28,42.29 35.28,41.53 36.2,40.62 C3.1 42.23,32.7 42.23,26.35 42.27,26.31 42.29,26.31 43.2,25.4 R10.2 | v51.12,24.13 v48.58,24.13
  Bottom 0.2: R12.1 60.68,17.75 60.68,20.78 59.83,21.63 57.77,21.63 55.9,23.5 51.75,23.5 v51.12,24.13 | v50.16,52.07 51.52,52.07 51.63,52.18 59.8,52.18 R3.2 | R9.2 39.64,56.52 42.93,59.8 44.89,59.8 45.52,59.18 45.52,58.3 44.45,57.23 IC3.2 | v48.58,24.13 45.72,24.13 R10.2
N$10
  Top 0.2: C4.1 55.88,53.02 R6.1 R5.2
  Bottom 0.2: R6.1 53.66,53.34 53.34,53.66 IC3.6
N$12
  Top 0.2: C11.+ 62.23,79.38 62.23,40.01 61.59,39.37 59.39,39.37 54.97,34.94 54.97,22.9 C2.2 54.29,21.91 IC2.7
  Bottom 0.2: R12.2 60.01,18.41 60.01,20.95 59.69,21.27 56.52,21.27 55.56,22.23 C2.2
N$13
  Top 0.2: VR2.3 14.94,13 C7.-
N$14
  Top 0.2: C7.+ 13.65,8.57 3.81,8.57 2.62,7.38 U1.P$1_TIP
N$15
  Bottom 0.2: C5.2 60.05,28.54 60.05,31.77 61.87,33.59 61.87,34.35 58.42,37.8 R7.1
N$16
  Top 0.2: C6.2 61.87,29.89 61.87,27.24 61.87,25.49 62.22,25.14 62.22,24.39 61.59,23.77 R8.1
N$17  (via drill 0.35)
  Top 0.2: R13.2 37.15,71.73 35.28,73.6 35.28,77.53 37.7,79.94 37.7,82.98 38.1,83.39 v38.1,84.77 | v43.18,95.89 43.9,95.89 44.01,95.77 49.5,95.77 51.63,97.9 52.51,97.9 53.13,97.28 53.13,96.37 52.07,95.31 IC4.7
  Bottom 0.2: IC4.7 53.66,94.3 C8.2 | D3.A 40.46,56.83 39.23,55.6 38.36,55.6 37.15,56.81 37.15,65.52 36.84,65.83 36.84,66.88 37.15,67.19 R13.2 | v43.18,95.89 42.57,95.89 42.29,96.16 41.53,96.16 40.38,95.02 40.38,91.97 39.79,91.38 39.46,91.38 38.1,90.02 v38.1,84.77
N$18
  Top 0.2: IC1.6 46.04,34.29 46.04,38.73 IC1.3
  Bottom 0.2: IC1.3 44.45,40.91 42.88,42.48 42.88,43.24 43.81,44.17 45.17,44.17 46.02,45.02 46.02,45.99 42.81,49.21 D3.C
N$21
  Bottom 0.2: U2.P$1_TIP 2.62,42.94 3.81,44.13 7.3,44.13 10.12,46.95 VR3.3
N$23  (via drill 0.35)
  Top 0.2: R17.1 43.5,97.79 IC4.1 50.06,96.84 51.48,98.25 52.66,98.25 54.75,96.16 54.99,96.16 55.52,95.63 55.52,94.87 54.99,94.34 54.31,94.34 53.7,93.72 53.7,91.4 v54.93,90.17
  Bottom 0.2: v54.93,90.17 55.78,89.31 55.78,86.75 56.52,86.02 56.52,80.57 57.14,79.95 57.14,78.79 56.52,78.17 R18.2
N$26  (via drill 0.35)
  Top 0.2: C10.1 41.27,75.86 40.36,76.77 40.36,77.53 40.9,78.06 41.87,78.06 IC5.2 | v35.24,71.44 35.24,54.61 R21.2 36.2,52.09 35.28,51.18 35.28,45.36 R20.1
  Bottom 0.2: C10.1 37.49,73.98 36.57,74.89 35.82,74.89 34.93,74 34.93,71.75 v35.24,71.44
N$27
  Top 0.2: R19.1 16.83,42.55 26.99,42.55 27.86,41.67 U3.P$1_TIP
N$28
  Top 0.2: VR5.2 22.68,46.98 20.97,48.69 17.25,48.69 R19.2
N$29  (via drill 0.35)
  Top 0.2: v43.18,76.2 43.18,78.34 44.42,79.58 44.89,79.58 45.52,80.2 45.52,81.09 44.45,82.15 IC5.1 | R22.1 57.81,77.79 56.89,76.88 56.14,76.88 55.6,77.41 55.6,77.77 54.2,79.17 51.63,79.17 51.01,78.55 51.01,77.04 v49.53,75.56 | v47.31,74.93 46.35,75.88 v46.35,76.2
  Bottom 0.2: v49.53,75.56 48.9,74.93 v47.31,74.93 | v46.35,76.2 45.32,76.2 44.89,76.63 44.01,76.63 43.58,76.2 v43.18,76.2 42.19,75.21 42.19,73.6 41.65,73.06 37.9,73.06 36.99,73.98 C10.2 36.2,70.82 35.28,69.91 35.28,50.42 36.2,49.51 R20.2
N$31
  Top 0.2: R25.2 R23.1 57.81,73.03 56.89,73.94 56.24,73.94 IC5.6 53.98,78.11 C12.1
N$33
  Top 0.2: R24.1 R23.2
  Bottom 0.2: IC5.7 53.38,79.33 53.38,73.62 C12.2 R24.1
N$34
  Bottom 0.2: C11.- 61.59,78.44 61.87,78.17 61.87,71.4 R25.1
N$37
  Top 0.2: IC6.6 IC6.7
N$38
  Top 0.508: D5.C 42.04,10.16 L1.2
N$39  (via drill 0.35)
  Top 0.2: C14.2 44.45,73.98 IC6.1 | v48.9,81.92 48.9,80.33 v47.62,79.06 | v46.04,57.47 46.99,58.42 47.94,58.42 48.26,58.74 v48.26,59.05
  Bottom 0.2: R26.1 v48.9,81.92 | C14.2 43.9,77.15 44.01,77.04 45.61,77.04 v47.62,79.06 | R27.2 38.73,45.7 39.65,46.61 39.65,50.76 43.81,54.93 45.4,54.93 46.04,55.56 v46.04,57.47 | v48.26,59.05 47.5,59.82 47.5,62.12 45.52,64.1 45.52,69.97 44.45,71.04 IC6.1
N$40
  Top 0.2: IC6.2 42.29,69.53 40.01,67.25 | R28.2 40.01,52.07 40.01,67.25 | C14.1 37.11,76.23 37.11,74.15 39.01,72.25 39.01,69.83 38.77,69.59 38.77,68.84 40.01,67.61 40.01,67.25
  Bottom 0.2: R27.1 R28.2
N$41
  Top 0.508: D6.A 54.48,10.16 L2.2
N$42
  Top 0.508: J1.2 J1.1 54.61,2.54 D6.C
N$43
  Top 0.508: J1.10 J1.9 41.91,2.54 D5.A
RESO_POT1
  Top 0.2: VR1.3 VR1.2 14.75,62.53 13.67,61.45 11.81,61.45 4.82,68.44 4.82,84.35 7.36,86.89 7.36,95.35 6.35,96.37 HEADR3.2
RESO_POT2  (via drill 0.35)
  Top 0.2: VR1.1 12.42,62.53 6.36,68.59 6.36,82.22 v6.35,82.23
  Bottom 0.2: v6.35,82.23 6.35,85.88 5.34,86.89 5.34,95.95 HEADR3.1
TO_BP_CONN
  Bottom 0.2: R22.2 58.74,76.5 57.83,77.41 57.83,78.17 58.36,78.7 58.38,78.7 59.05,79.38 59.05,80.64 57.78,81.92 57.78,82.75 58.68,83.64 58.68,90.27 59.69,91.29 HEADR2.5
TO_CUTOFF_POT1
  Top 0.2: R15.1 56.52,95.89 56.52,95.57 HEADR2.4
TO_CUTOFF_POT2  (via drill 0.35)
  Top 0.2: HEADR2.6 58.68,90.87 60.11,90.87 61.91,89.06 v61.91,86.04
  Bottom 0.2: R29.2 60.09,78.65 60.09,84.22 v61.91,86.04
TO_CV1_POT
  Top 0.2: R14.1 58.68,84.71 58.68,88.33 HEADR2.8
TO_CV2_POT1  (via drill 0.35)
  Top 0.2: C8.1 52.07,90.81 IC4.6 52.07,92.71 R15.2 | C8.1 54.61,86.38 54.33,86.1 54.33,84.73 R14.2 53.13,81.71 53.13,80.2 52.51,79.58 51.01,79.58 v48.9,77.47 | R13.1 40.64,70.17 43.18,70.17 43.81,70.8 45.4,70.8 v46.35,71.75 | C8.1 54.61,88.96 55.56,89.91 55.56,92.23 57.24,93.92 57.57,93.92 58.16,94.51 58.16,95.95 HEADR2.1
  Bottom 0.2: IC4.6 50.25,91.76 49.18,92.82 44.34,92.82 R17.2 | v48.9,77.47 46.35,74.93 v46.35,71.75
TO_CV2_POT2
  Bottom 0.2: IC4.2 48.05,97.9 52.51,97.9 53.7,96.72 53.7,94.87 54.23,94.34 54.99,94.34 55.56,94.91 55.56,96.84 56.2,97.47 HEADR2.2 58.68,95.95 60.11,95.95 60.7,95.35 60.7,94.51 60.11,93.92 59.78,93.92 58.16,92.3 58.16,83.63 57.43,82.9 57.43,81.77 58.7,80.5 58.7,79.54 57.47,78.31 57.47,77.45 56.52,76.5 R18.1
TO_HP_CONN  (via drill 0.35)
  Top 0.2: HEADR2.9 59.69,84.77 56.83,81.91 56.83,79.37 v56.51,79.05
  Bottom 0.2: R26.2 55.24,85.11 54.33,84.2 54.33,80.9 56.18,79.05 v56.51,79.05
TO_INPUT_POT  (via drill 0.35)
  Top 0.2: R5.1 61.32,61 61.34,61 61.87,61.53 61.87,62.29 60.05,64.12 60.05,70.86 61.3,72.11 61.34,72.11 61.87,72.65 61.87,73.4 61.34,73.94 60.98,73.94 59.65,75.27 59.65,78.46 v57.78,80.33
  Bottom 0.2: HEADR2.10 57.08,87.24 57.08,81.04 v57.78,80.33
TO_LP_CONN  (via drill 0.35)
  Top 0.2: v55.56,78.74 55.56,79.67 54.33,80.9 54.33,81.66 54.87,82.19 54.91,82.19 58.16,85.45 58.16,87.73 57.06,88.84 56.73,88.84 56.14,89.43 56.14,90.27 56.73,90.87 57.57,90.87 58.59,89.85 HEADR2.7
  Bottom 0.2: v55.56,78.74 55.56,73.98 R24.2
TO_RESO_POT1  (via drill 0.35)
  Top 0.2: 36.14,35.56 34.24,33.66 34.24,27.36 D2.A D1.C 39.37,25.4 R10.1 C1.2 42.86,22.54 43.18,22.23 IC2.1 | 36.14,35.56 C30.1 | C13.+ 36.2,79.44 34.58,77.82 34.58,39.06 36.14,37.5 36.14,35.56 | v47.31,19.37 v49.21,17.46
  Bottom 0.2: IC2.1 v47.31,19.37 | v49.21,17.46 50.88,17.46 51.83,18.41 53.66,18.41 55.56,20.32 R1.1 | HEADR4.1 37.84,95.95 36.41,95.95 35.24,94.78 35.24,85.09 36.2,84.14 C13.+
TO_RESO_POT2  (via drill 0.35)
  Top 0.2: v42.55,65.72 42.55,60.05 43.14,59.46 43.14,55.6 44.45,54.29 IC3.3 | R11.2 40.64,73.32 40.01,73.95 40.01,77.68 40.38,78.05 40.38,95.35 39.79,95.95 38.36,95.95 HEADR4.2
  Bottom 0.2: v42.55,65.72 42.55,70.17 41.59,71.12 R11.2
V+  (via drill 0.35)
  Top 0.2: C27.2 54.28,38.75 54.28,40.7 53.39,41.59 50.34,41.59 | C19.2 43.38,91.87 43.38,91.32 44.21,90.49 46.99,90.49 48.46,89.01 48.46,88.9 | 48.46,88.38 48.46,88.58 | v46.04,60.33 v49.21,60.33
  Top 0.508: C15.+ 39.53,12.79 43.98,12.79 46.1,10.67 L1.1 47.6,11.28 47.6,11.32 50.48,14.21 50.48,18.1 | IC1.16 52.07,45.03 50.34,43.3 50.34,41.59 50.34,28.57 46.99,25.22 46.99,21.59 50.48,18.1 | IC6.8 51.62,72.07 47.68,76.01 47.68,77.97 52.07,82.37 IC5.8 52.07,84.77 48.46,88.38 | IC4.8 52.07,96.02 48.46,92.42 48.46,88.9 48.46,88.58 | IC2.8 50.48,20.64 50.48,18.1
  Bottom 0.2: IC3.8 54.91,58.74 55.5,58.14 60.05,58.14 C21.2 | C23.2 53.8,67.63 | C17.2 42.23,61.28 43.18,60.33 v46.04,60.33 | 53.8,64.45 51.85,62.51 51.03,62.51 50.5,61.97 50.5,61.61 v49.21,60.33
  Bottom 0.508: IC1.16 48.58,48.9 48.58,55.24 IC3.8 52.07,59.43 53.8,61.15 53.8,64.45 53.8,67.63 53.8,69.53 52.07,71.26 IC6.8
V-
  Top 0.2: C20.1 41.91,86.68 IC4.4 | C24.1 53.52,64.77 52.77,65.52 45.52,65.52 IC6.4 | C22.1 37.82,43.54 37.82,44.83 38.36,45.36 39.33,45.36 R16.2 41.29,47.32 42.29,47.32 44.45,49.48 IC3.4
  Top 0.508: L2.1 52.32,10.67 53.49,11.84 54.46,11.84 54.66,11.63 58.24,11.63 C16.- | IC5.4 44.45,75.88 46.84,78.27 46.84,79.38 48.11,80.65 48.11,82.24 49.53,83.66 49.53,86.04 46.35,89.22 IC4.4
  Bottom 0.2: C28.1 57.76,33.97 54.97,31.18 54.97,30.52 IC1.9 52.07,25.72 D7.A | IC6.4 40.96,64.45 39.05,66.36 C18.1
  Bottom 0.508: L2.1 47.5,12.7 46.35,12.7 IC2.4 49.53,19.68 49.53,24.45 52.07,26.99 IC1.9 46.67,33.02 46.67,48.9 IC3.4 46.99,53.66 46.99,61.91 IC6.4 44.45,65.27 43.23,66.49 43.23,72.58 44.45,73.8 IC5.4

### Text on the board
bPlace: kocmoc svf / v 1.7 | power of the / hydro cubes